# EasyEDA schematic Sheet_1.json
TITLE: Sheet_1; REV: 1.0; Date: 2021-06-27; Sheet: 1/1; Drawn By: EfeBostanci; Company: Your Company
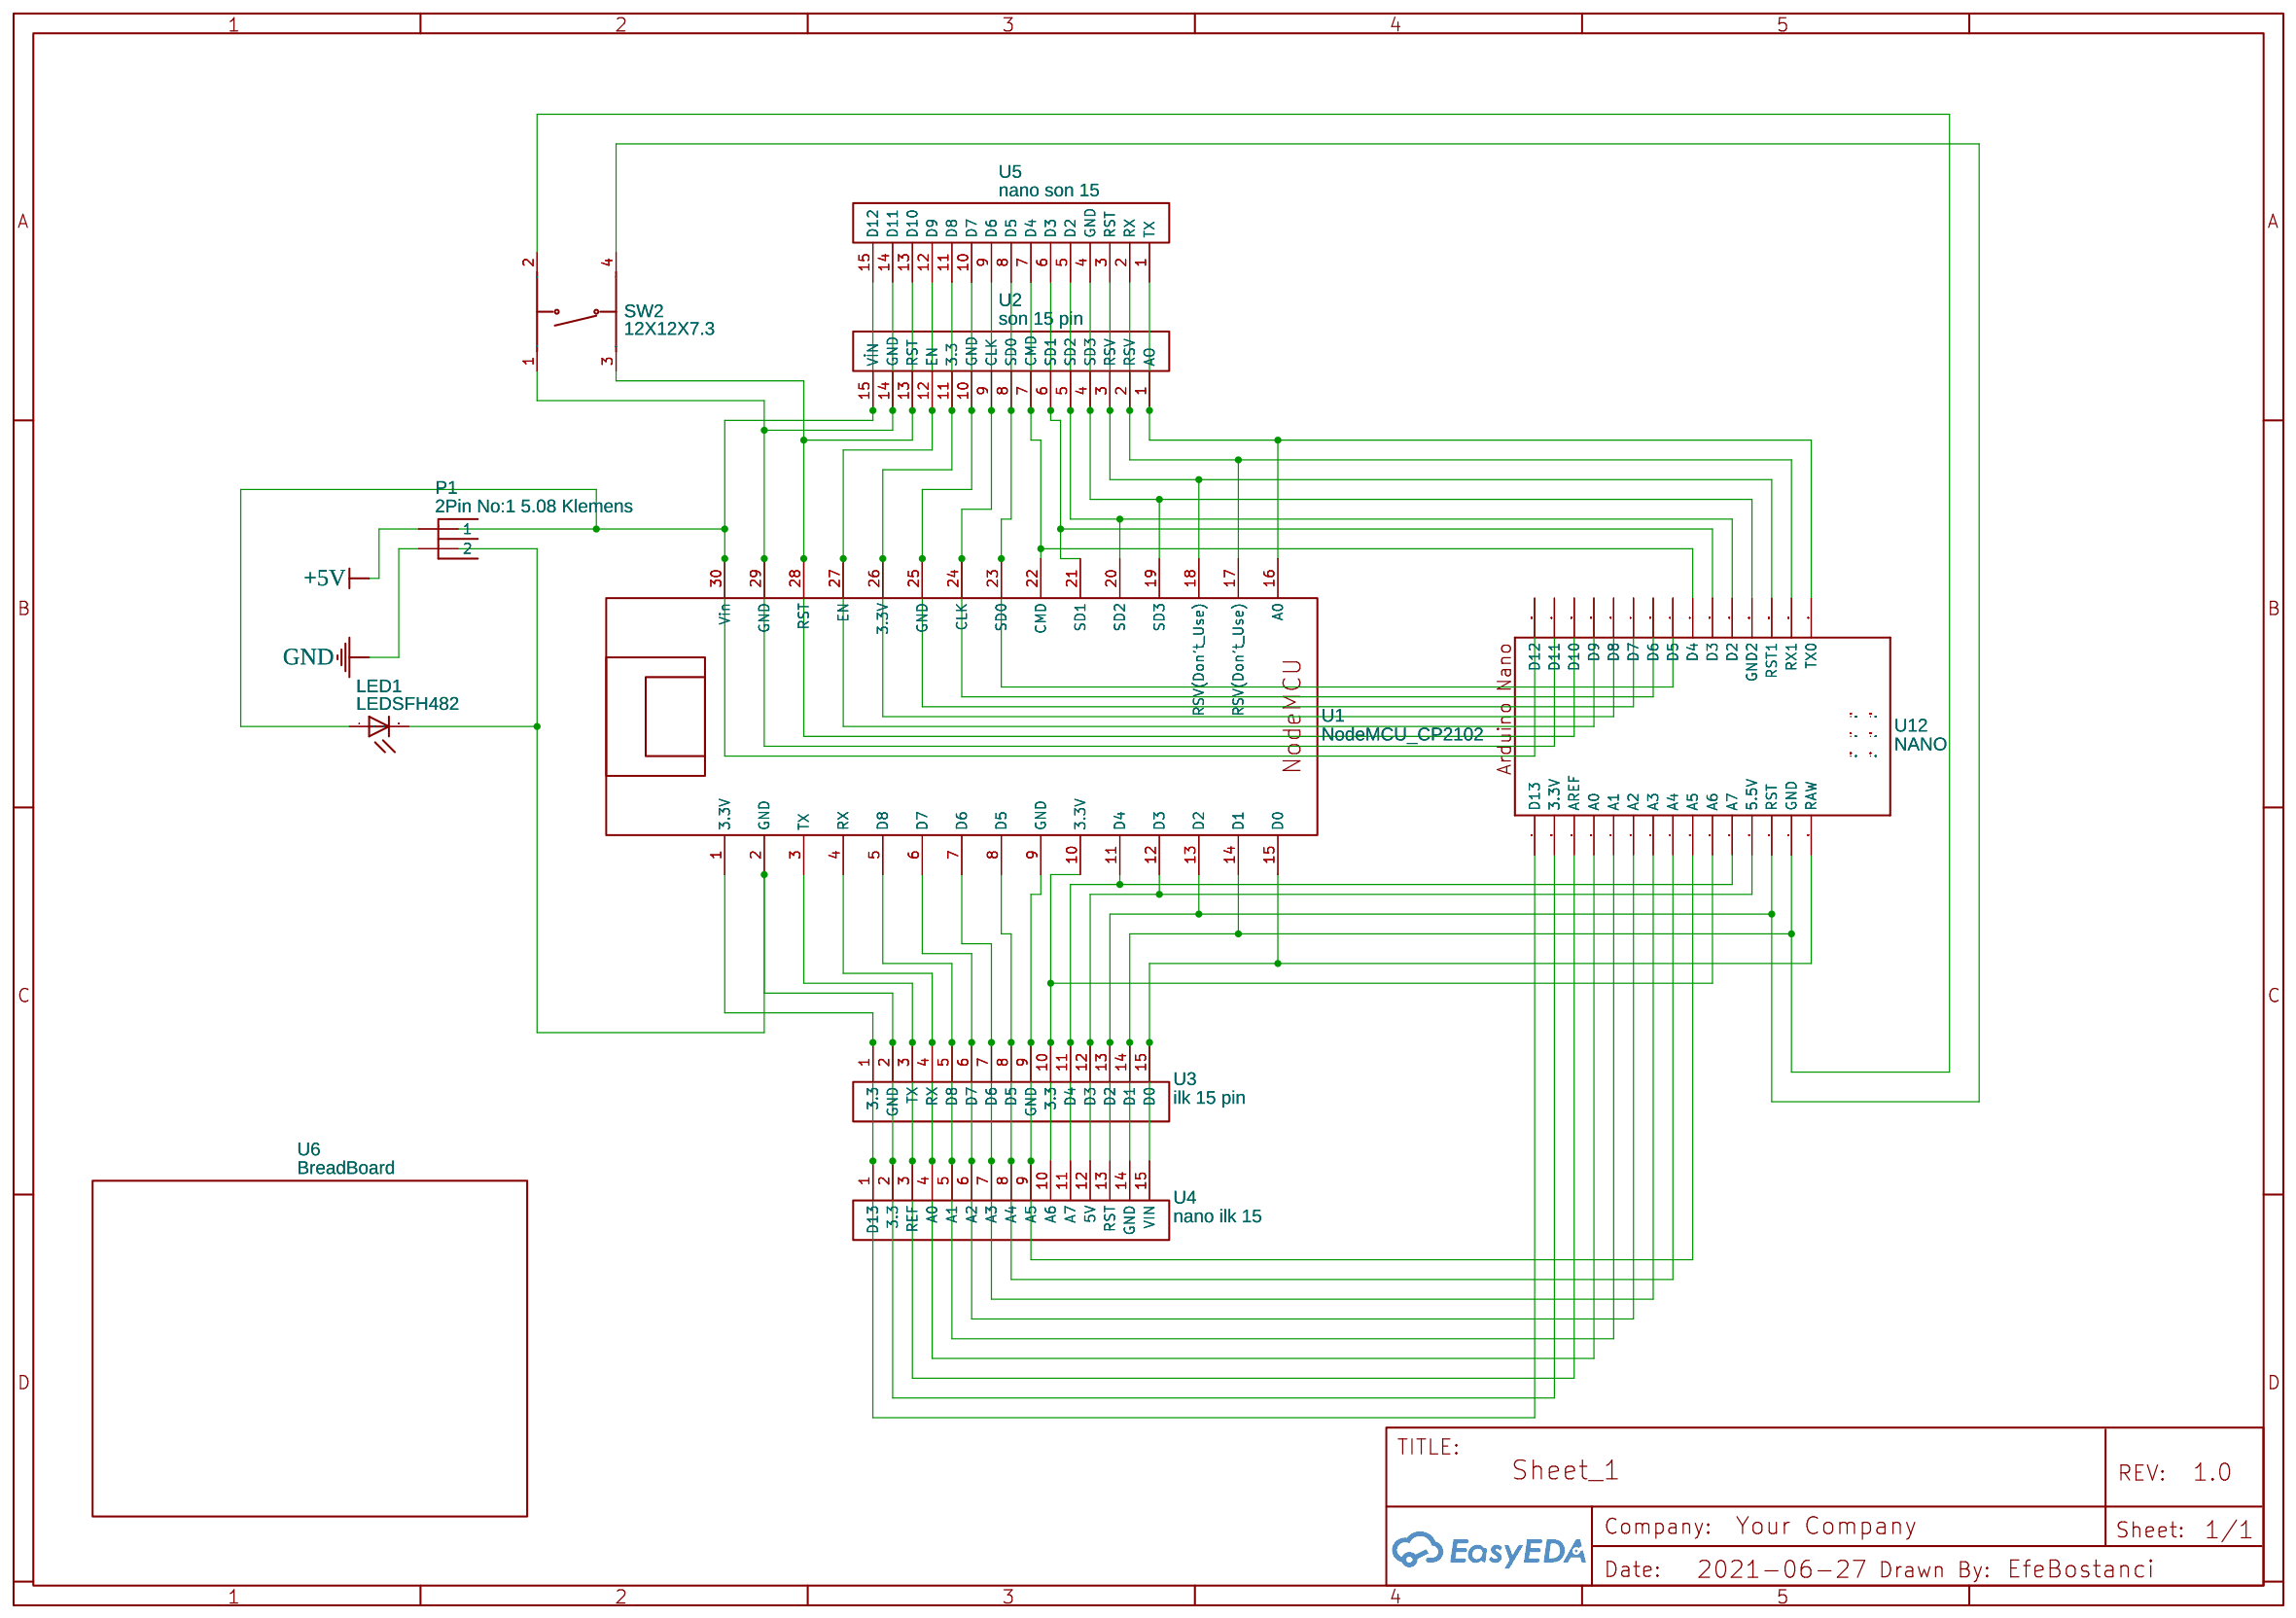
[diagram p0: schematic sheet]

## Parts
LED1  LEDSFH482  [SFH482]
P1  2Pin No:1 5.08 Klemens  [2PIN NO:1 5.08 KLEMENS]
SW2  12X12X7.3  [SW-TH_4P-L12.0-W12.0-P5.00-LS12.5]
U1  NodeMCU_CP2102  [NODEMCU_CP2102]
U2  son 15 pin  [15 PIN]
U3  ilk 15 pin  [15 PIN]
U4  nano ilk 15  [15 PIN]
U5  nano son 15  [15 PIN]
U6  BreadBoard  [BREADBOARD]
U12  NANO  [NANO]

## Library data of the parts
LED1 = LEDSFH482: LED; Contributor: Adafruit
P1 = 2Pin No:1 5.08 Klemens: Manufacturer Part: Terminal 2Pol 5,08mm; Contributor: bilmekyetermi
SW2 = 12X12X7.3: Supplier: LCSC; Supplier Part: C10861; Manufacturer: Boom Precision Elec; Contributor: LCSC; JLCPCB Part Class: Extended Part
U1 = NodeMCU_CP2102: Contributor: Vakhtang
U2-U5 = 15 pin: Contributor: franco.fumanti
U6 = BreadBoard: Contributor: arvind444pandit
U12 = NANO: Arduino Nano

## Nets
+5V: P1.1
GND: P1.2
Net-(LED1-A): LED1.A U1.30(Vin) U2.15(VİN) U5.15(D12) U12.D12
Net-(LED1-K): LED1.K(C) U1.2(GND) U3.2(GND) U4.2(3.3) U12.3.3V
Net-(SW2-1): SW2.1 U1.29(GND) U2.14(GND) U5.14(D11) U12.D11
Net-(SW2-2): SW2.2 U1.14(D1) U3.14(D1) U4.14(GND) U12.GND
Net-(SW2-3): SW2.3 U1.28(RST) U2.13(RST) U5.13(D10) U12.D10
Net-(SW2-4): SW2.4 U1.13(D2) U3.13(D2) U4.13(RST) U12.RST
Net-(U1-1): U1.1(3.3V) U3.1(3.3) U4.1(D13) U12.D13
Net-(U1-3): U1.3(TX) U3.3(TX) U4.3(REF) U12.AREF
Net-(U1-4): U1.4(RX) U3.4(RX) U4.4(A0) U12.A0
Net-(U1-5): U1.5(D8) U3.5(D8) U4.5(A1) U12.A1
Net-(U1-6): U1.6(D7) U3.6(D7) U4.6(A2) U12.A2
Net-(U1-7): U1.7(D6) U3.7(D6) U4.7(A3) U12.A3
Net-(U1-8): U1.8(D5) U3.8(D5) U4.8(A4) U12.A4
Net-(U1-9): U1.9(GND) U3.9(GND) U4.9(A5) U12.A5
Net-(U1-10): U1.10(3.3V) U3.10(3.3) U4.10(A6) U12.A6
Net-(U1-11): U1.11(D4) U3.11(D4) U4.11(A7) U12.A7
Net-(U1-12): U1.12(D3) U3.12(D3) U4.12(5V) U12.5V(5.5V)
Net-(U1-15): U1.15(D0) U3.15(D0) U4.15(VIN) U12.RAW
Net-(U1-16): U1.16(A0) U2.1(AO) U5.1(TX) U12.TX0
Net-(U1-17): U1.17(RSV(Don't Use)) U2.2(RSV) U5.2(RX) U12.RX1
Net-(U1-18): U1.18(RSV(Don't Use)) U2.3(RSV) U5.3(RST) U12.RST1
Net-(U1-19): U1.19(SD3) U2.4(SD3) U5.4(GND) U12.GND1(GND2)
Net-(U1-20): U1.20(SD2) U2.5(SD2) U5.5(D2) U12.D2
Net-(U1-21): U1.21(SD1) U2.6(SD1) U5.6(D3) U12.D3
Net-(U1-22): U1.22(CMD) U2.7(CMD) U5.7(D4) U12.D4
Net-(U1-23): U1.23(SD0) U2.8(SD0) U5.8(D5) U12.D5
Net-(U1-24): U1.24(CLK) U2.9(CLK) U5.9(D6) U12.D6
Net-(U1-25): U1.25(GND) U2.10(GND) U5.10(D7) U12.D7
Net-(U1-26): U1.26(3.3V) U2.11(3.3) U5.11(D8) U12.D8
Net-(U1-27): U1.27(EN) U2.12(EN) U5.12(D9) U12.D9

Not connected (* = marked no-connect by the designer): U12 ICSP1 ICSP2 ICSP3 ICSP4 ICSP5 ICSP6
